# Altium schematic sheet synchronous.SchDoc
size 127 x 127 mm; SheetNumber: 2; SheetTotal: 6
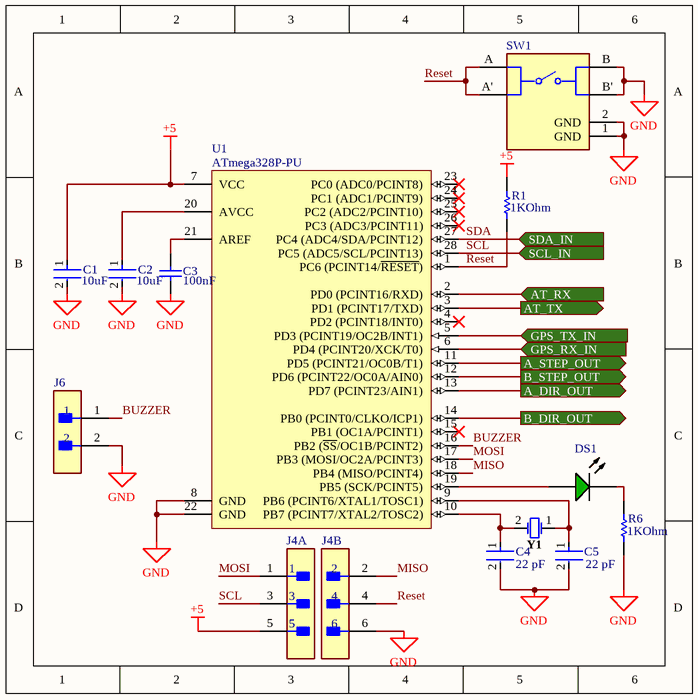
[diagram p0: synchronous.SchDoc]

## Parts
C1  Capacitance: 10uF  [FP-1206-L_3_2_0_2-W_1_6_0-IPC_B]  (hidden comment: 1206YD106KAT2A)
C2  Capacitance: 10uF  [FP-1206-L_3_2_0_2-W_1_6_0-IPC_B]  (hidden comment: 1206YD106KAT2A)
C3  value 100nF  [CAPC2013X140X50LL20T25]  (hidden comment: 08055F104KAT2A)
C4  Capacitance: 22 pF  [FP-C0805C-DN-MFG]  (hidden comment: C0805C220K3GACTU)
C5  Capacitance: 22 pF  [FP-C0805C-DN-MFG]  (hidden comment: C0805C220K3GACTU)
DS1  HSMG-C170  [AVAG-HSMX-C170_V]  (value not drawn)
J4  M20-9980346  [FP-M20-9980346-MFG]  (value not drawn)  (parts A,B of 2)
J6  B2B-XH-A(LF)(SN)  [FP-B2B-XH-A_LF_SN-MFG]  (value not drawn)
R1  Resistance: 1KOhm  [RESC2013X60X35ML10T20]  (hidden comment: RC0805FR-071KL)
R6  Resistance: 1KOhm  [RESC2013X60X35ML10T20]  (hidden comment: RC0805FR-071KL)
SW1  EVQ-PLMA15  [FP-EVQ-PLMA15-MFG]  (value not drawn)
U1  ATmega328P-PU  [28P3]
Y1  FOXSLF/160-20  [FOX-FOXSLF160-20]  (value not drawn)

## Ports
A_DIR_OUT (out, see Top_domain[7D]), A_STEP_OUT (out, see Top_domain[7C]), AT_RX (in, see Top_domain[4C]), AT_TX (out, see Top_domain[7C]), B_DIR_OUT (out, see Top_domain[7D]), B_STEP_OUT (out, see Top_domain[7D]), GPS_RX_IN (in, see Top_domain[4C]), GPS_TX_IN (in, see Top_domain[4D]), SCL_IN (in, see Top_domain[4D]), SDA_IN (in, see Top_domain[4D])

## Nets
+5: C1.1 J4.5 R1.2 U1.7(VCC)
GND: C1.2 C2.2 C3.1 C4.2 C5.2 J4.6 J6.2 R6.1 SW1.1(GND) SW1.2(GND) SW1.B SW1.B' U1.8(GND) U1.22(GND)
A_DIR_OUT: U1.13(PD7_(PCINT23/AIN1)) ; port A_DIR_OUT
A_STEP_OUT: U1.11(PD5_(PCINT21/OC0B/T1)) ; port A_STEP_OUT
AT_RX: U1.2(PD0_(PCINT16/RXD)) ; port AT_RX
AT_TX: U1.3(PD1_(PCINT17/TXD)) ; port AT_TX
B_DIR_OUT: U1.14(PB0_(PCINT0/CLKO/ICP1)) ; port B_DIR_OUT
B_STEP_OUT: U1.12(PD6_(PCINT22/OC0A/AIN0)) ; port B_STEP_OUT
BUZZER: J6.1 U1.16(PB2_(~{SS}/OC1B/PCINT2))
GPS_RX_IN: U1.6(PD4_(PCINT20/XCK/T0)) ; port GPS_RX_IN
GPS_TX_IN: U1.5(PD3_(PCINT19/OC2B/INT1)) ; port GPS_TX_IN
MISO: J4.2 U1.18(PB4_(MISO/PCINT4))
MOSI: J4.1 U1.17(PB3_(MOSI/OC2A/PCINT3))
Reset: J4.4 R1.1 SW1.A SW1.A' U1.1(PC6_(PCINT14/~{RESET}))
SCL: J4.3 U1.28(PC5_(ADC5/SCL/PCINT13)) ; port SCL_IN
SDA: U1.27(PC4_(ADC4/SDA/PCINT12)) ; port SDA_IN
NetC2_1: C2.1 U1.20(AVCC)
NetC3_2: C3.2 U1.21(AREF)
NetC4_1: C4.1 U1.10(PB7_(PCINT7/XTAL2/TOSC2)) Y1.2
NetC5_1: C5.1 U1.9(PB6_(PCINT6/XTAL1/TOSC1)) Y1.1
NetDS1_1: DS1.1(A) U1.19(PB5_(SCK/PCINT5))
NetDS1_2: DS1.2(K) R6.2

Not connected (* = marked no-connect by the designer): U1 4(PD2_(PCINT18/INT0))* 15(PB1_(OC1A/PCINT1))* 23(PC0_(ADC0/PCINT8))* 24(PC1_(ADC1/PCINT9))* 25(PC2_(ADC2/PCINT10))* 26(PC3_(ADC3/PCINT11))*

## Library data of the parts
C1 C2 = CMP-04427-000082-1: General Purpose Ceramic Capacitor, 1206, 10uF, 10%, X5R, 15%, 16V; Max Operating Temperature: 85°C; Tolerance: 10%; Dielectric: X5R; Series: -; Case Code (Imperial): 1206; Width: 1.6mm; Termination: SMD/SMT; Voltage Rating: 16V; REACH SVHC: No SVHC; Length: 3.2mm; Size: 1.78mm; Package Quantity: 1; Voltage: 16V; RoHS Compliant: Yes; Thickness: 0.07inch; Mount: Surface Mount; Radiation Hardening: No; Voltage Rating (DC): 16V; Min Operating Temperature: -55°C; Case Code (Metric): 3216; Construction: Flat; Depth: 1.6mm; Height: 0.07mm; Lead Free: Lead Free; Number of Pins: 2; Case/Package: 1206; Packaging: Tape and Reel
C3 = CMP-2007-04784-1: Manufacturer: AVX Interconnect / Elco; Part Number: 08055F104KAT2A
C4 C5 = CMP-2007-00528-2: CAP CER 22PF 25V 10% NP0 0805; Manufacturer: KEMET; Temperature Coefficient: 30ppm/°C; Temperature Characteristic: C0G; Material: Ceramic; Tolerance: 0.1; Temperature Range High: +125°C; Value: 22 pF; Temperature Range Low: -55°C; Category: Cap; Manufacturer Part Number: C0805C220K3GACTU; Automotive: No; Lead Free: Yes; Voltage Rating: 25 V; ComponentLink2URL: https://content.kemet.com/datasheets/KEM_C1003_C0G_SMD.pdf; Package: C0805C-DN; ComponentLink2Description: Datasheet; Device Class L2: Capacitors; RoHS: TRUE; Height: 0.88mm; Device Class L3: Ceramic Capacitors; Octopart: https://octopart.com/c0805c220k3gactu-kemet-12580612; Digikey Description: CAP CER 22PF 25V 10% NP0 0805; Temperature: -55°C to +125°C; Device Class L1: Passive Components; Ipc Land Pattern Name: CAPC200125X78; Mouser Description: Multilayer Ceramic Capacitors MLCC - SMD/SMT 25volts 22pF C0G 10%
DS1 = CMP-2000-05062-1: Chip LED, Green, 2.2 V, -40 to 85 degC, 2-Pin SMD, Pb-Free, Tape and Reel; Manufacturer: Avago; No. of Pins: 2; Peak Wavelength: 570nm; SVHC: NoSVHC(16-Jun-2014); Dominant Wavelength: 572nm; Forward Current If: 20mA; Viewing Angle: 170deg; Lens Shape: Rectangular; PIV Max: 5V; External Width: 1.25mm; LED Type: Standard; External Depth: 0.8mm; Opto Mounting Orientation: Top; Luminous Intensity: 15mcd; Luminous Intensity Min: 4mcd; Forward Voltage VF Max: 2.6V; External Length / Height: 2mm; Bulb Size: 1.25mmx1.4mm; Light Area Height: 1mm; Voltage Vf Typ: 2.2V; Operating Temperature Max: 85degC; Datasheet Version: Oct-08; MSL: MSL2A-4weeks; Peak Forward Current: 20mA; Package Description: 2-Pin Surface Mount Device, Body 2 x 1.25 mm, Height 0.8 mm; Datasheet URL: https://datasheet.ciiva.com/29280/180495-da-01-en-chip-led-hsmg-c170-gelb-gruen-29280971.pdf; Storage Temperature Min: -40degC; LED Colour: Green; Wavelength Typ: 570nm; Mounting Type: SMD; Forward Current If Max: 20mA; Dominant Wavelength Typ: 572nm; LED Mounting: SMD; Operating Temperature Range: -30degCto+85degC; Operating Temperature Min: -30degC; Manufacturer URL: http://www.avagotech.com/; Packaging: CutTape; Luminous Intensity Typ: 15mcd; Package Reference: HSMX-C170; Storage Temperature Max: 85degC; Opto Case Style: SMD; Forward Voltage: 2.2V
J4 = CMP-2000-06636-2: CONN HEADER VERT 6POS 2.54MM; Manufacturer: Harwin; Current Rating: 3A; Number Of Contacts: 6; Conn Gender: Male; Conn Orientation: Vertical; Device Class L1: Connectors; ComponentLink2Description: Datasheet; Height: 8.99mm; Temperature Range High: +105°C; Contact Material: Tin,Nickel; RoHS: TRUE; Temperature Range Low: -40°C; ComponentLink2URL: https://cdn.harwin.com/pdfs/M20-998.pdf; Digikey Description: CONN HEADER VERT 6POS 2.54MM; Pitch: 2.54mm; Package: M20-9980346; Device Class L2: Headers and Wire Housings; Manufacturer Part Number: M20-9980346; Number Of Rows: 2; Category: Conn; Lead Free: Yes; Mouser Description: 2.54mm (0.1") Pitch DIL Vertical PC Tail Pin Header, 6.1mm mating pin height, tin, 3+3 contacts; Temperature: -40°C to +105°C; Device Class L3: unset; Octopart: https://octopart.com/m20-9980346-harwin-5436545; Automotive: No
J6 = CMP-2000-05888-3: CONN HEADER VERT 2POS 2.5MM; Current Rating: 3A; Voltage Rating: 250V; Number of Contacts: 2; Contact Resistance: 20mR; Wire/Cable Gauge: 22AWG; Insulation Resistance: 1GR; Connector Type: Male Pin; Packaging: Bulk; Contact Material: Brass; Lead Free: Lead Free; Orientation: Straight; Contact Plating: Tin; Max Current Rating: 3A; Termination: Solder; Fastening Type: Detent; Depth: 5.75mm; Housing Material: Polyamide; REACH SVHC: No SVHC; Series: XH; Voltage Rating (AC): 250V; Number of Positions: 2; Color: Natural; Contact Type: Male Pin; Max Voltage Rating (DC): 250V; Pitch: 2.5mm; Lead Pitch: 2.5mm; Mount: Through Hole; Max Operating Temperature: 85°C; Length: 7.4mm; Max Voltage Rating (AC): 250V; Min Operating Temperature: -25°C; Number of Rows: 1; Housing Color: White
R1 R6 = CMP-2100-03671-1: Chip Resistor, 1 KOhm, +/- 1%, 125 mW, -55 to 155 degC, 0805 (2012 Metric), RoHS, Tape and Reel; Manufacturer: Yageo; Temperature Coefficient: 100ppm/degreesC; Voltage Rating (DC): 150V; Max Power Dissipation: 125mW; Number of Pins: 2; Number of Terminations: 2; Datasheet URL: http://www.yageo.com/NewPortal/yageodocoutput?fileName=/pdf/R-Chip/PYu-RC_Group_51_RoHS_L_5.pdf; Length: 0.079inch; Package Description: 2-Pin Surface Mounted Device, Body 2 x 1.25 mm; Depth: 1.25mm; Height: 0.024inch; Military Standard: Not; Case/Package: 0805; Package Reference: 0805; RoHSCompliant: true; Lead Free: LeadFree; Packaging: TapeandReel; Package Quantity: 1; Datasheet Version: Rev. 5, 10/2016; Tolerance: 1%; Min Operating Temperature: -55degC; Voltage Rating: 150V; Composition: ThickFilm; Case Code (Imperial): 0805; Power Rating: 125mW; Width: 0.049inch; Case Code (Metric): 2012; Manufacturer URL: http://www.yageo.com/; Max Operating Temperature: 155degC; REACH SVHC: Unknown; Termination: SMD/SMT
SW1 = CMP-05618-000006-1: SWITCH TACTILE SPST-NO 0.02A 15V; Manufacturer: Panasonic Electronic Components; Operating Force: 2.6N; Contact Resistance: 50mΩ; Contact Current Rating: 20mA; Electromechanical Life: 200000Cycles; Throw Configuration: SPST-NO; Automotive: No; Digikey Description: SWITCH TACTILE SPST-NO 0.02A 15V; Device Class L3: Tactile Switches; Device Class L2: Switches; Temperature Range Low: -20°C; ComponentLink2Description: Datasheet; RoHS: TRUE; Mount: Surface Mount; Package: 0; Height: 1.7mm; Octopart: https://octopart.com/evq-plma15-panasonic-39850235; Temperature Range High: +70°C; Device Class L1: Electromechanical; Category: Switch; Mouser Description: Tactile Switches FLAT ACT 2.6NF 4.6x3.4x1.5mm; Voltage Rating Dc: 15V; Manufacturer Part Number: EVQ-PLMA15; ComponentLink2URL: https://datasheet.ciiva.com/8164/atv0000ce2-8164994.pdf; Lead Free: Yes; Temperature: -20°C to +70°C
U1 = CMP-0095-00013-2: 8-bit AVR Microcontroller, 32KB Flash, 1KB EEPROM, 2KB SRAM, 28-pin PDIP, Industrial Grade (-40°C to 85°C); RevisionNote: DatasheetVersion updated. URLs added.; PackageVersion: revB, Sep-2001; PackageDescription: 28-lead (0.300"/7.62mm Wide) Plastic Dual Inline Package (PDIP); DatasheetVersion: revD, May-2011; ComponentLink1Description: Manufacturer URL; ComponentLink1URL: http://www.atmel.com/; PackageReference: 28P3; ComponentLink2Description: ATmega48A/48PA/88A/88PA/168A/168PA/328/328P Datasheet; ComponentLink3URL: http://www.atmel.com/dyn/resources/prod_documents/8271S.pdf; ComponentLink2URL: http://www.atmel.com/dyn/resources/prod_documents/8271.pdf; ComponentLink3Description: ATmega48A/48PA/88A/88PA/168A/168PA/328/328P Summary
Y1 = CMP-1749-00003-1: Resistance Weld Thru-Hole Crystal, 16 MHz, -20 to 70 degC, 2-Pin THD, RoHS, Bulk; Voltage Rating: 250 V; Tolerance: 1%; Resistance: 221 kohm; Case\Package: Axial; Power Rating: 250 mW; RoHSCompliant: true; Package Quantity: 200; Packaging: Bulk; Min Operating Temperature: -55 degC; DatasheetVersion: Mar-15; ComponentLink1URL: http://www.foxonline.com/; Max Operating Temperature: 155 degC; PackageReference: FOXSLF160-20; Mount: Through Hole; PackageDescription: 2-Pin Through Hole Device, Body 11.35 x 4.65 mm; ComponentLink1Description: Manufacturer URL; ComponentLink2URL: http://www.foxonline.com/pdfs/hc49slf.pdf; ComponentLink2Description: Datasheet; Length: 0.248 inch